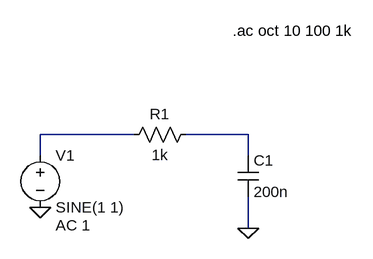
[diagram p0: schematic Draft2.asc]
Draft2.asc, the LTspice schematic file:
Version 4.1
SHEET 1 880 680
WIRE 256 112 112 112
WIRE 432 112 336 112
WIRE 112 144 112 112
WIRE 432 144 432 112
WIRE 432 256 432 208
FLAG 112 224 0
FLAG 432 256 0
SYMBOL cap 416 144 R0
SYMATTR InstName C1
SYMATTR Value 200n
SYMBOL res 352 96 R90
WINDOW 0 0 56 VBottom 2
WINDOW 3 32 56 VTop 2
SYMATTR InstName R1
SYMATTR Value 1k
SYMBOL voltage 112 128 R0
WINDOW 123 24 124 Left 2
WINDOW 39 0 0 Left 0
SYMATTR Value2 AC 1
SYMATTR InstName V1
SYMATTR Value SINE(1 1)
TEXT 408 -48 Left 2 !.ac oct 10 100 1k

The netlist it stands for:
* Draft2.asc
C1 N002 0 200n
R1 N002 N001 1k
V1 N001 0 SINE(1 1) AC 1
.ac oct 10 100 1k
.backanno
.end